# EAGLE design battery_board_main (EAGLE 9.6.2)
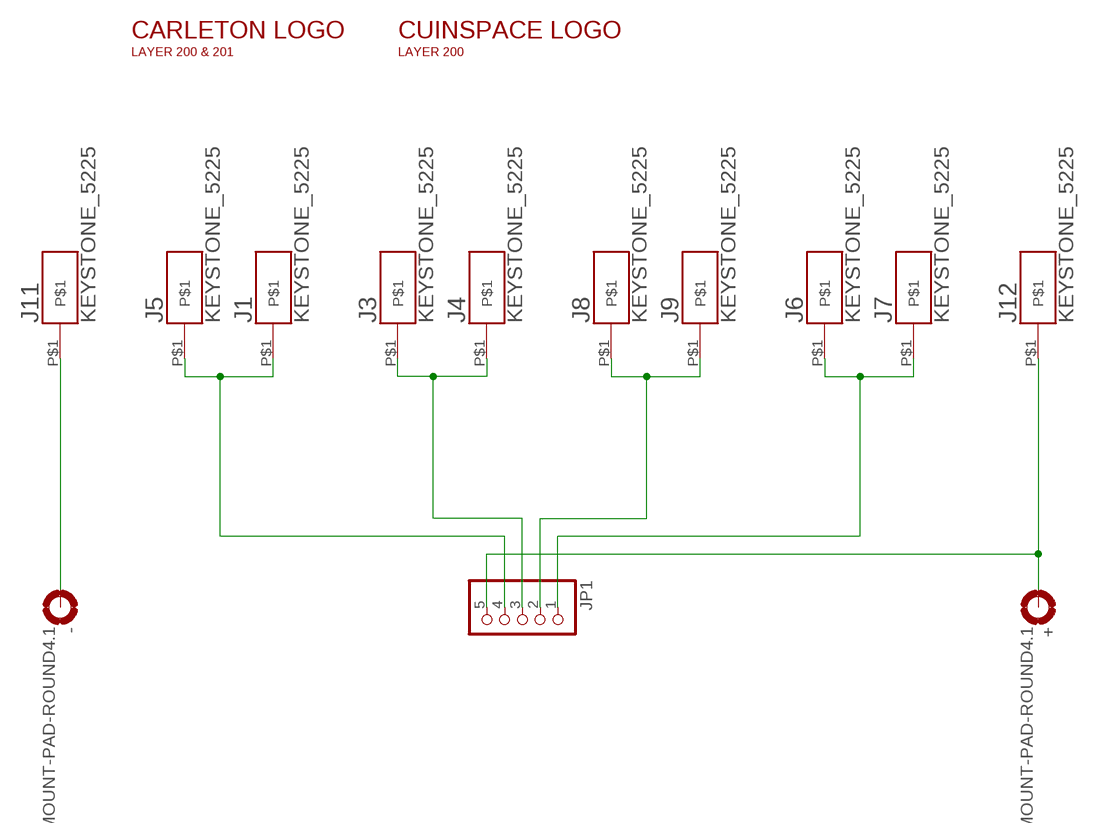
[diagram p0: schematic, sheet 1]

## Parts
+  MOUNT-PAD-ROUND4.1  [4,1-PAD]
-  MOUNT-PAD-ROUND4.1  [4,1-PAD]
J1  KEYSTONE_5225  [KEYSTONE_5225]
J3  KEYSTONE_5225  [KEYSTONE_5225]
J4  KEYSTONE_5225  [KEYSTONE_5225]
J5  KEYSTONE_5225  [KEYSTONE_5225]
J6  KEYSTONE_5225  [KEYSTONE_5225]
J7  KEYSTONE_5225  [KEYSTONE_5225]
J8  KEYSTONE_5225  [KEYSTONE_5225]
J9  KEYSTONE_5225  [KEYSTONE_5225]
J11  KEYSTONE_5225  [KEYSTONE_5225]
J12  KEYSTONE_5225  [KEYSTONE_5225]
JP1  PINHD-1X5  [1X05]
U$1  CARLETON3CM  [CARLETONU_3CM]
U$2  INSPACE3CM  [INSPACE_3CM]

## Nets
N$1: J1.P$1 J5.P$1 JP1.4
N$2: J3.P$1 J4.P$1 JP1.3
N$3: J8.P$1 J9.P$1 JP1.2
N$4: J6.P$1 J7.P$1 JP1.1
N$5: -.B4,1(MOUNT) J11.P$1
N$6: +.B4,1(MOUNT) J12.P$1 JP1.5

## Library data of the parts
+ - = holes:MOUNT-PAD-ROUND: MOUNTING PAD, round
J1 J3-J9 J11 J12 = Battery_Contacts:KEYSTONE_5225
JP1 = pinhead:PINHD-1X5: PIN HEADER
U$1 = Logos:CARLETON
U$2 = Logos:INSPACE

## Board
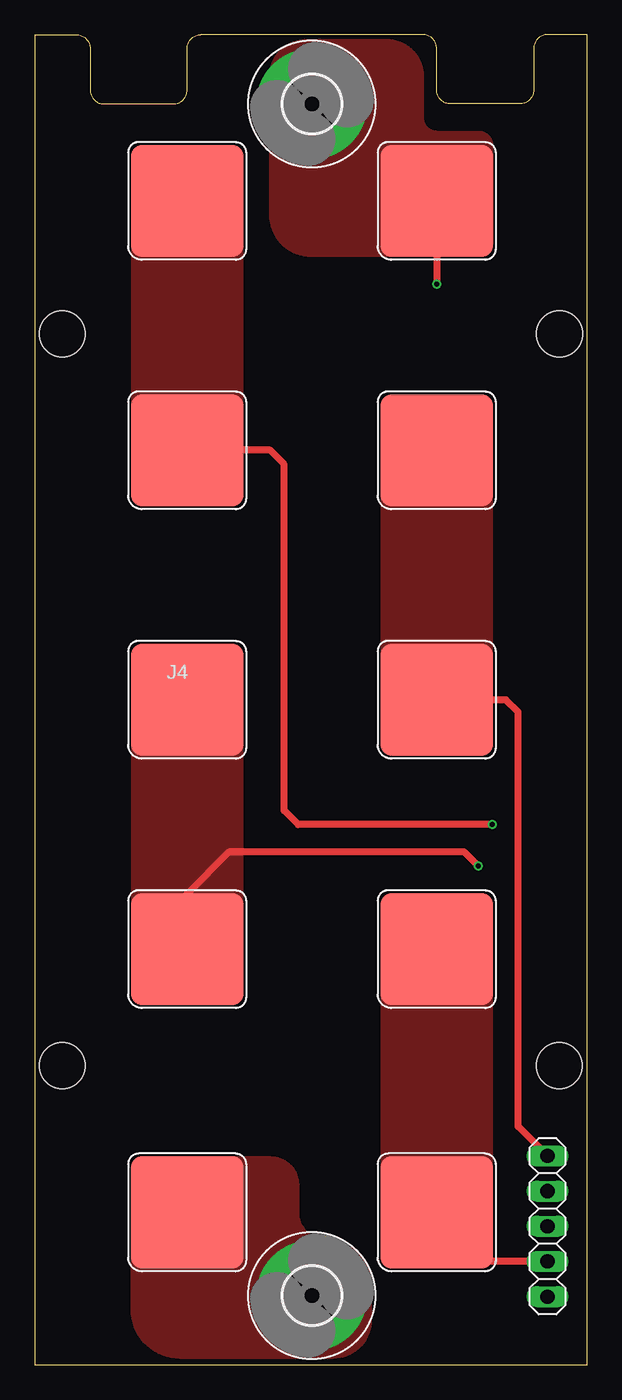
[diagram p1: board, top side]
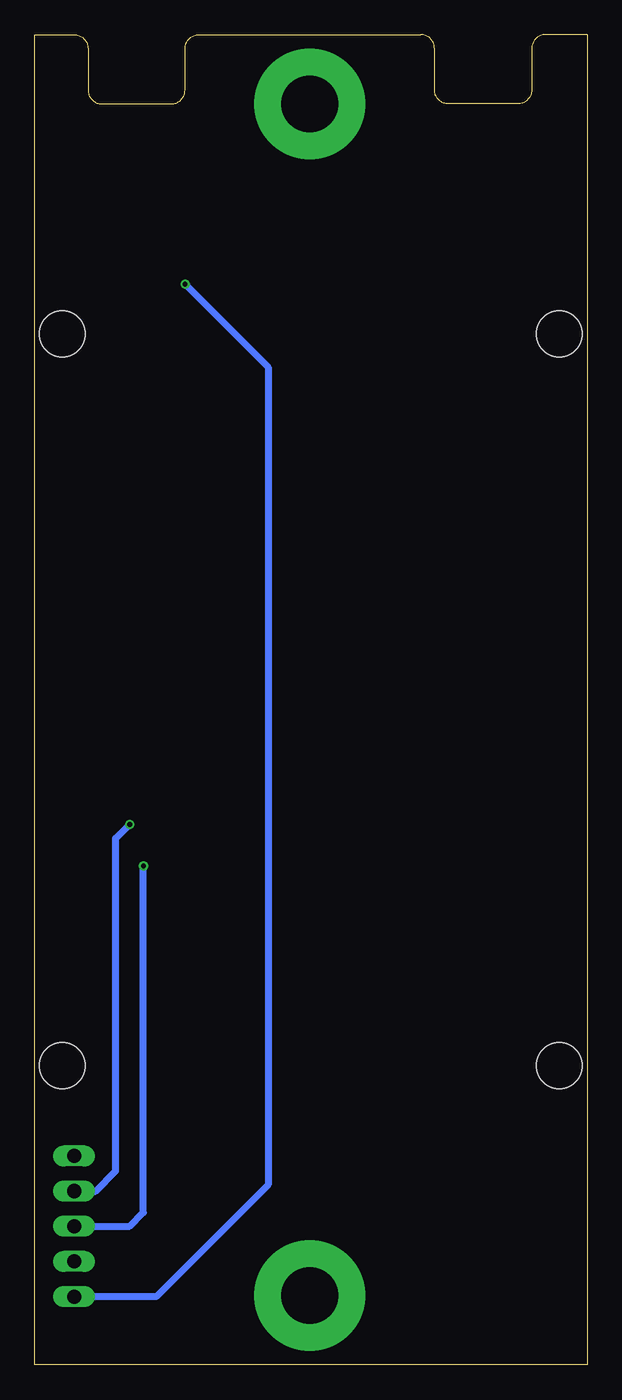
[diagram p2: board, bottom side, seen from below]

Size 39.85 x 96 mm. Coordinates in mm from the lower left corner, seen from the top.
Outline: 0,0 39.85,0 39.85,96 37,96 arc90 36,95 36,92 arc-90 35,91 30,91 arc-90 29,92 29,95 arc90 28,96 12,96 arc90 11,95 11,92 arc-90 10,91 5,91 arc-90 4,92 4,95 arc90 3,96 0,96 0,0
Copper layers (1*16): Top 0.035mm / dielectric 1.5mm / Bottom 0.035mm
Design rules "JLCPCB": minimum track width 3.5mil, minimum drill 0.2mm, track to track 5mil, track to pad 5mil, pad to pad 5mil, via to via 5mil, smd to smd 0mil, copper to edge 10mil, drill to drill 10mil, minimum pad ring 3mil, minimum via ring 6mil, stop-mask expansion 2mil, vias tented up to drill 25mil, thermal gap 10mil
Holes 3.3 mm at 37.86,74.4 2,74.4 37.85,21.6 2,21.6

### Footprints (pad centres in the part's own frame; a part is rotated, then mirrored left to right if it is on the bottom)
4,1-PAD = drill 4.1 pad 8: B4,1 0,0
KEYSTONE_5225 = smd 8.1 x 8.1: P$1 0,0
1X05 = drill 1.016 long: 1 -5.08,0; 2 -2.54,0; 3 0,0; 4 2.54,0; 5 5.08,0

### Placement (x,y rotation side)
+  20,91 0 top
-  20,5 0 top
J1  29,11 0 top
J3  11,30 0 top
J4  11,48 0 top
J5  29,30 0 top
J6  29,48 0 top
J7  29,66 0 top
J8  11,84 0 top
J9  11,66 0 top
J11  11,11 0 top
J12  29,84 0 top
JP1  37,10 270 top
U$1  36,26 0 bottom
U$2  35,61 0 bottom

### Tracks (layer width: path | path; a pad name or v marks a point on that pad's centre or on a via)
N$1
  Top 0.5: JP1.4 32.54,7.46 J1.P$1
  pour Top: 25,27 33,27 33,14 25,14
N$2  (via drill 0.35)
  Top 0.5: v32,36 31,37 14,37 11,34 J3.P$1
  Bottom 0.5: JP1.3 33,10 32,11 v32,36
  pour Top: 7,45 15,45 15,33 7,33
N$3  (via drill 0.35)
  Top 0.5: v33,39 19,39 18,40 18,65 17,66 J9.P$1
  Bottom 0.5: JP1.2 35.46,12.54 34,14 34,38 v33,39
  pour Top: 7,81 15,81 15,69 7,69
N$4
  Top 0.5: JP1.1 34.87,17.21 34.87,47.13 34,48 J6.P$1
  pour Top: 25,63 25,51 33,51 33,63
N$5
  pour Top (no thermals): 7,4 7,14 arc-90 8,15 17,15 arc-90 19,13 19,11 arc90 21,9 arc-90 24.25,5.75 24.25,3.25 arc-90 21.49,0.49 10.51,0.49 arc-90
N$6  (via drill 0.35)
  Top 0.5: J12.P$1 v29,78
  Bottom 0.5: v29,78 23,72 23,13 31.08,4.92 JP1.5
  pour Top (no thermals): 32,80 20,80 arc-90 17,83 17,93 arc-90 19.64,95.64 25.36,95.64 arc-90 28,93 28,90 arc90 29,89 32,89 arc-90 33,88 33,81 arc-90